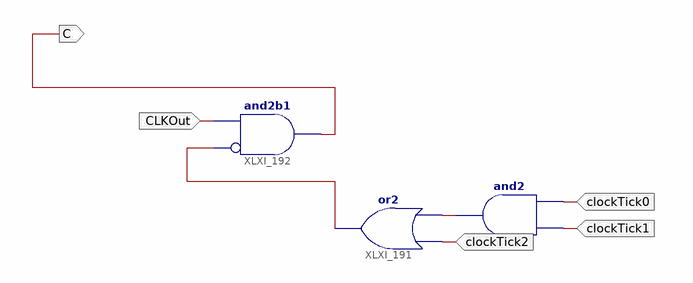
[diagram p0: schematic sheet 1]
// Xilinx ISE schematic YOGI_ET.sch (spartan3e) as structural Verilog: 3 symbols, 5 ports
module YOGI_ET (
  input  CLKOut,
  input  clockTick2,
  input  clockTick1,
  input  clockTick0,
  output C
);

  wire XLXN_684, XLXN_685;

  and XLXI_192 (C, ~XLXN_684, CLKOut);  // and2b1
  or XLXI_191 (XLXN_684, XLXN_685, clockTick2);
  and XLXI_193 (XLXN_685, clockTick0, clockTick1);
endmodule
